# Altium schematic sheet Power.SchDoc: {Наименование}
size 420 x 297 mm; ApprovedBy: {Утвердил}; CheckedBy: {Проверил}; DrawnBy: {Разработал}; Engineer: {Инженер}; DocumentNumber: {Обозначение}; SheetNumber: {}; SheetTotal: {}; Scale: {Масш.}; Title1str: {Наименование}; PageSetup: Record=PageOptions|CenterHorizontal=False|CenterVertical=False|PrintScale=0.95|XCorrection=0.00|YCorrection=0.00|PrintKind=1|BorderSize=5000000|LeftOffset=0|BottomOffset=0|Orientation=1|PaperLength=1000|PaperWidth=1000|Scale=100|PaperSource=15|PrintQuality=600|MediaType=1|DitherType=10|PaperKind=A4|PrintScaleMode=1; Title2str: {Наименование}; ProcessInspection: {Т.контр.}; Mass: {Масса}; NormInspection: {Н.контр.}; EngineerName: {Инженер}; Letter1Column: {}; Letter2Column: {}; Letter3Column: {}; DocumentType: {Документ}; DocumentType1str: {Документ}; DocumentType2str: {Документ}; ImagePath: {Перв. применение}; Rule: PcbType=ProtelPcb
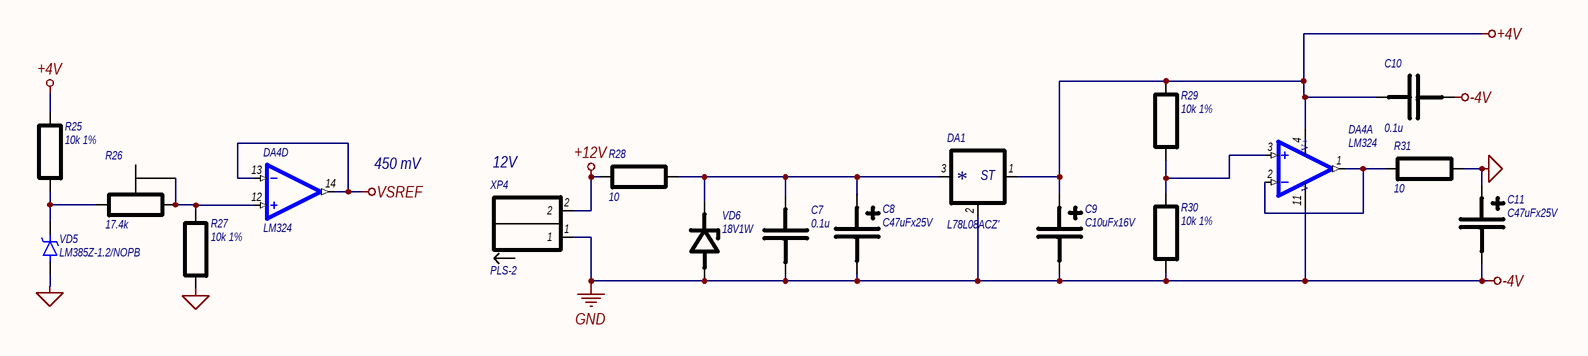
[diagram p0: Power.SchDoc]

## Parts
C7  0.1u  [CR2012-0805]
C8  C47uFx25V  [C6.3x11]
C9  C10uFx16V  [C6.3x11]
C10  0.1u  [CR2012-0805]
C11  C47uFx25V  [C6.3x11]
DA1  L78L08ACZ'  [to-92]
DA4  LM324  [SOIC127P600X175-14N]  (parts A,D of 4)
R25  10k 1%  [CR2012-0805]
R26  17.4k  [3296W]
R27  10k 1%  [CR2012-0805]
R28  10  [R-1W]
R29  10k 1%  [CR2012-0805]
R30  10k 1%  [CR2012-0805]
R31  10  [R-1W]
VD5  LM385Z-1.2/NOPB  [DIO_LM385Z-2.5/NOPB]
VD6  18V1W  [DO-41]
XP4  PLS-2  [PLS-2]

## Nets
+4V: C9.1 C10.1 DA1.1(Vout) DA4.4(VCC+) R25.2 R29.2
+12V: R28.1 XP4.2
-4V: C7.2 C8.2 C9.2 C10.2 C11.2 DA1.2(GND) DA4.11(VCC-) R30.1 VD6.1(A) XP4.1  [also labelled GND]
SGND: C11.1 R27.1 R31.2 VD5.1(A)
VSREF: DA4.13(INVERTING_INPUT4) DA4.14(OUTPUT4)
NetC7_1: C7.1 C8.1 DA1.3(Vin) R28.2 VD6.2(K)
NetDA4_1: DA4.1(OUTPUT1) DA4.2(INVERTING_INPUT1) R31.1
NetDA4_3: DA4.3(NON-INVERTING_INPUT1) R29.1 R30.2
NetDA4_12: DA4.12(NON-INVERTING_INPUT4) R26.2 R26.3 R27.2
NetR25_1: R25.1 R26.1 VD5.2(C)

## Notes on the sheet
- (near DA4) 450 mV
- 12V
- Перв. примен.
- Справ. №
- Подп. и дата
- Инв. № дубл.
- Взам. инв. №
- Изм.
- Лист
- № докум.
- Подп.
- Дата
- Лит.
- Масса
- Масштаб
- Т.контр.
- Пров.
- Разраб.
- Листов
- Инв. № подл.
- Н.контр.
- Утв.
- Копировал
- Формат А3
- (in symbol L78L08ACZ') ST
- (in symbol LM324, part A) V+; V-

## Library data of the parts
C7 C10 = C0805-0.1u-X7R
DA4 = LM324: General Purpose Amplifier 4 Circuit 14-SOIC; MF: Texas Instruments; Price: None; MP: LM324; Package: SOIC-14 Texas Instruments; Value: *; Availability: Unavailable; SnapEDA_Link: https://www.snapeda.com/parts/LM324/Texas%20Instruments/view-part/2758578/?ref=snap
R25 R27 R29 R30 = R0805-10k-1%
R26 = 3296W-1-103
R28 R31 = R-1W-10R
VD5 = LM385Z-2.5/NOPB: Shunt Voltage Reference IC Â±3% TO-92-3; MF: ON Semiconductor; Price: None; Package: TO-92 ON Semiconductor; Availability: Unavailable; SnapEDA_Link: https://www.snapeda.com/parts/LM385Z-2.5/ON%20Semiconductor/view-part/6788/?ref=snap; Value: *; MP: LM385Z-2.5
VD6 = 1N4746A